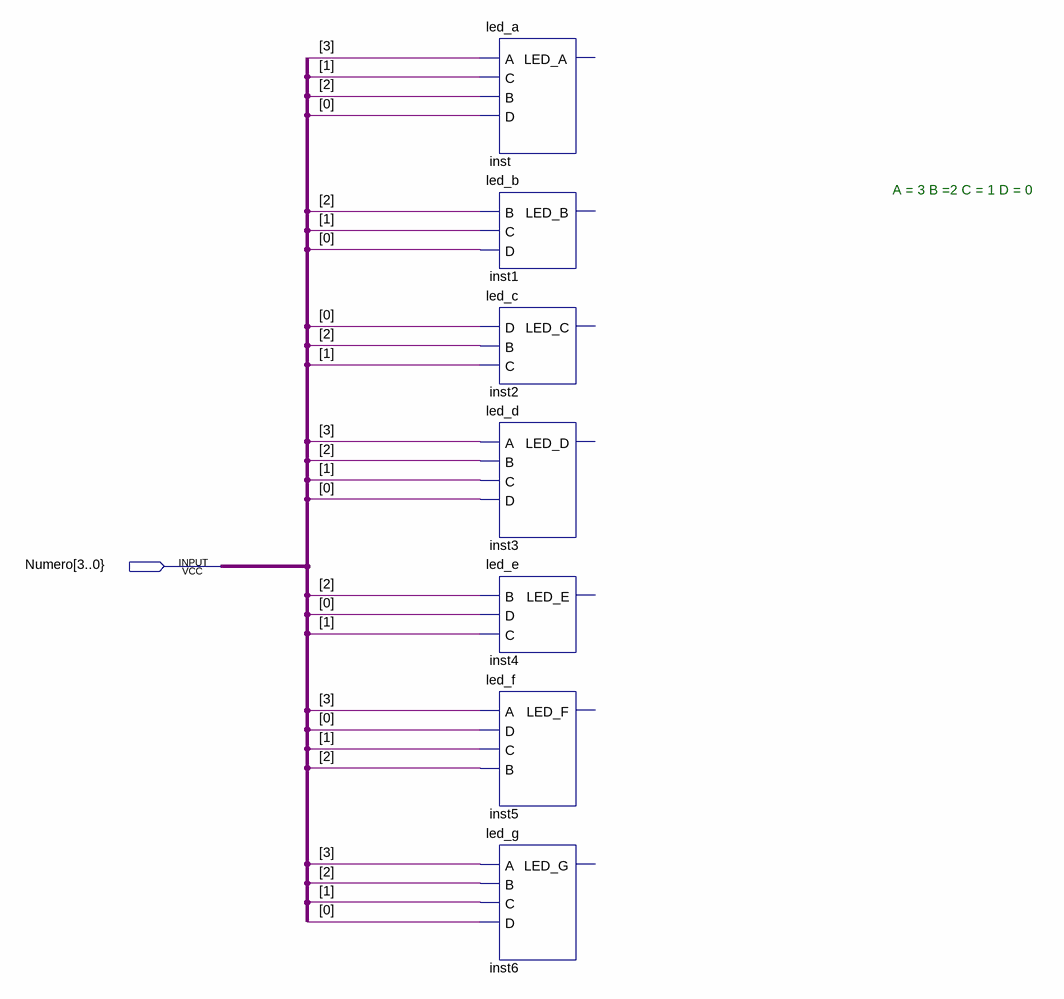
[diagram p0: schematic sheet]
// Quartus schematic Display.bdf as structural Verilog: 7 symbols, 1 pins
module Display (
  input  \Numero[3..0} 
);

  led_a inst (.A(\Numero[3..0} ), .C(\Numero[3..0} ), .B(\Numero[3..0} ), .D(\Numero[3..0} ));  // open: LED_A
  led_b inst1 (.B(\Numero[3..0} ), .C(\Numero[3..0} ), .D(\Numero[3..0} ));  // open: LED_B
  led_c inst2 (.D(\Numero[3..0} ), .B(\Numero[3..0} ), .C(\Numero[3..0} ));  // open: LED_C
  led_d inst3 (.A(\Numero[3..0} ), .B(\Numero[3..0} ), .C(\Numero[3..0} ), .D(\Numero[3..0} ));  // open: LED_D
  led_e inst4 (.B(\Numero[3..0} ), .D(\Numero[3..0} ), .C(\Numero[3..0} ));  // open: LED_E
  led_f inst5 (.A(\Numero[3..0} ), .D(\Numero[3..0} ), .C(\Numero[3..0} ), .B(\Numero[3..0} ));  // open: LED_F
  led_g inst6 (.A(\Numero[3..0} ), .B(\Numero[3..0} ), .C(\Numero[3..0} ), .D(\Numero[3..0} ));  // open: LED_G

  // Notes on the sheet:
  //   A = 3 B =2 C = 1 D = 0
endmodule
